# Altium schematic sheet sensor.SchDoc: Sensor
size A4; Address1: University of Colorado; Address2: Boulder; DocumentNumber: 4; Revision: 1; SheetNumber: 4; SheetTotal: 4
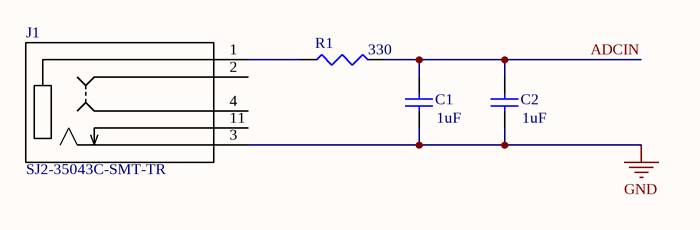
[diagram p0: sensor.SchDoc]

## Parts
C1  value 1uF  [1608[0603]]  (hidden comment: C1)
C2  value 1uF  [1608[0603]]  (hidden comment: C2)
J1  SJ2-35043C-SMT-TR  [CUI_SJ2-35043C-SMT-TR]
R1  value 330  [1608[0603]]  (hidden comment: R1)

## Nets
GND: C1.1 C2.1 J1.3(RING)
ADCIN: C1.2 C2.2 R1.2
NetJ1_1: J1.1(SLEEVE) R1.1

Not connected (* = marked no-connect by the designer): J1 2(TIP_1) 4(TIP_2) 11(RING_SWITCH)

## Notes on the sheet
- Title
- Size:
- Date:
- A4
- Number:
- Time:
- Revision:
- Sheet
- of
- File:

## Library data of the parts
C1 C2 = Cap: CAP CER 1UF 16V X7R 0603; Manufacturer: Samsung Electro-Mechanics; Manufacturer Part Number: CL10B105MO8NNWC; Published: 8-Jun-2000; LatestRevisionDate: 17-Jul-2002; LatestRevisionNote: Re-released for DXP Platform.; PackageReference: RAD-0.3; Publisher: Altium Limited; PackageDescription: Radial Cap, Thru-Hole; 2 Leads; 0.3 in Pin Spacing; Digi-Key Part Number: 1276-6524-1-ND; ComponentLink1URL: https://www.digikey.com/product-detail/en/samsung-electro-mechanics/CL10B105MO8NNWC/1276-6524-1-ND/5961383; ComponentLink1Description: Digi-Key Link
J1 = SJ2-35043C-SMT-TR: AUDIO JACK, 3.5 MM, RT, 4 CONDUC; Manufacturer: CUI Inc.; Value: *; Digi-Key Part Number: CP-SJ2-35043C-SMT-CT-ND; Manufacturer Part Number: SJ2-35043C-SMT-TR; ComponentLink1URL: https://www.digikey.com/products/en/connectors-interconnects/barrel-audio-connectors/434?k=SJ2-35043C-SMT-TR&k=&pkeyword=SJ2-35043C-SMT-TR&pv7=2&sf=0&quantity=&ColumnSort=0&page=1&pageSize=25; ComponentLink1Description: Digi-Key Link
R1 = Res3: RES SMD 330 OHM 5% 1/10W 0603; Manufacturer: Vishay Dale; Manufacturer Part Number: CRCW0603330RJNEAC; Published: 8-Jun-2000; LatestRevisionDate: 29-May-2009; LatestRevisionNote: IPC-7351 Footprint Added.; PackageReference: J1-0603; Publisher: Altium Limited; PackageDescription: Chip Resistor; Digi-Key Part Number: 541-4060-1-ND; ComponentLink1URL: https://www.digikey.com/product-detail/en/vishay-dale/CRCW0603330RJNEAC/541-4060-1-ND/7928743; ComponentLink1Description: Digi-Key Link